# EAGLE design UAV_ARM_Revision_2 (EAGLE 7.1.0)
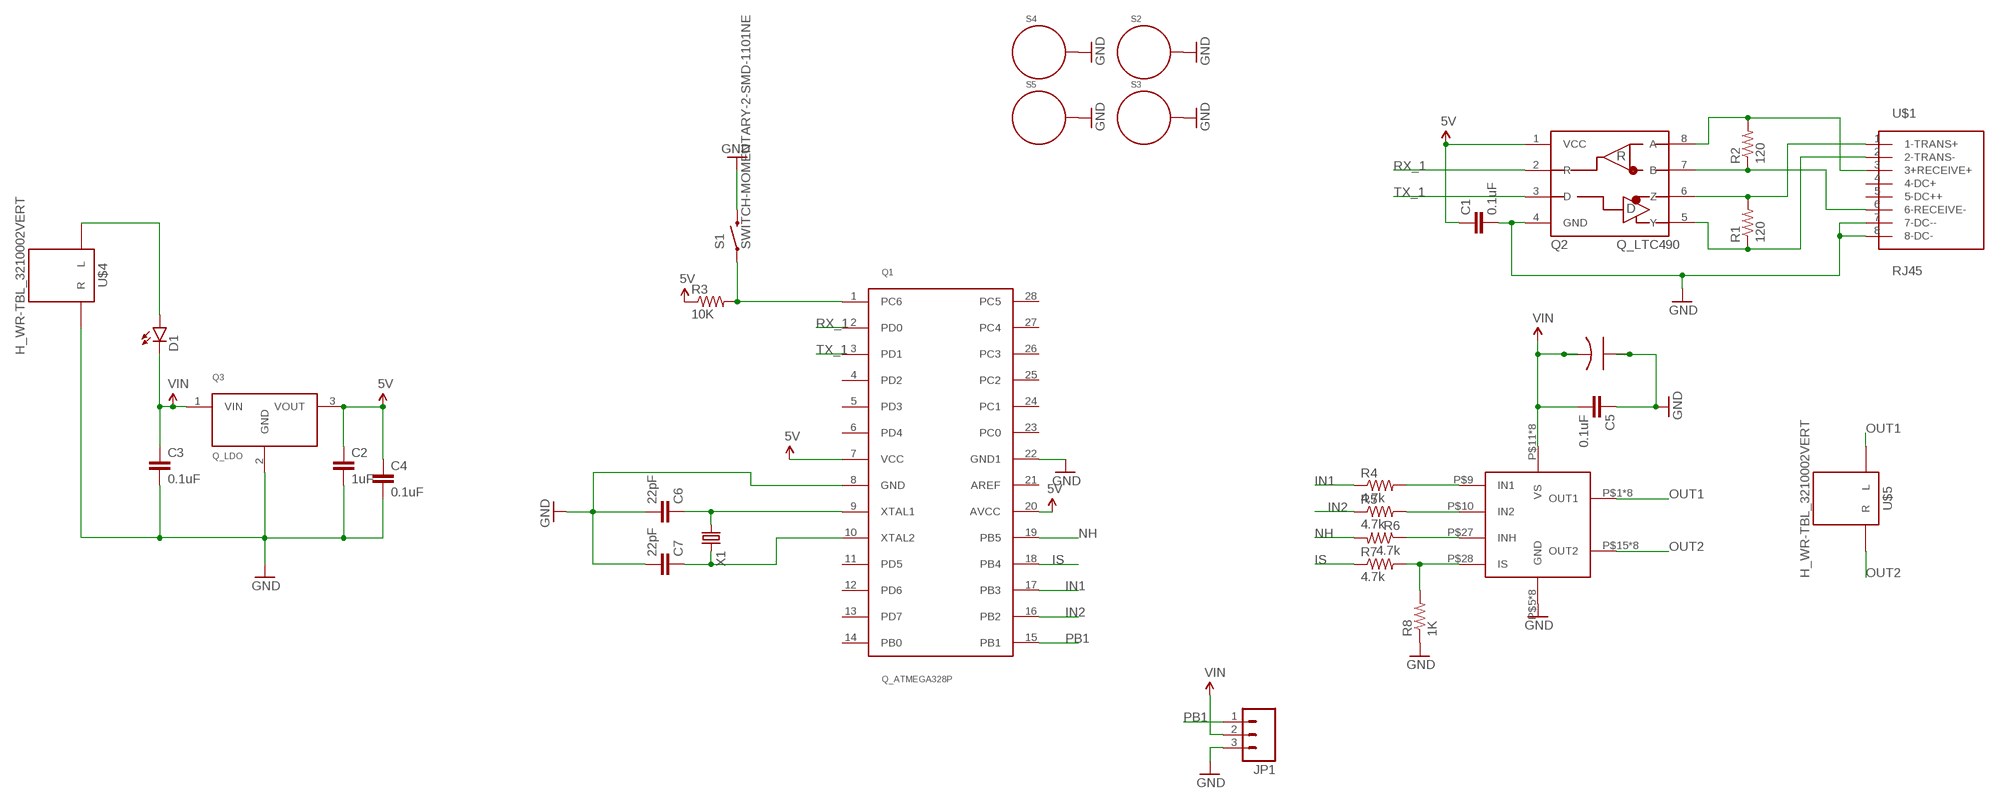
[diagram p0: schematic, sheet 1]

## Parts
C1  0.1uF  CAP1206  [1206]
C2  1uF  CAP1206  [1206]
C3  0.1uF  CAP1206  [1206]
C4  0.1uF  CAP1206  [1206]
C5  0.1uF  CAP1206  [1206]
C6  22pF  CAP1206  [1206]
C7  22pF  CAP1206  [1206]
D1  LED-FKIT-1206  [FKIT-LED-1206]
JP1  M03POLAR  [MOLEX-1X3]
Q1  Q_ATMEGA328P  [DIP28]
Q2  Q_LTC490  [DIP8]
Q3  Q_LDO  [TO-220]
R1  120  RESISTOR1206  [1206]
R2  120  RESISTOR1206  [1206]
R3  10K  RESISTOR1206  [1206]
R4  4.7k  RESISTOR1206  [1206]
R5  4.7k  RESISTOR1206  [1206]
R6  4.7k  RESISTOR1206  [1206]
R7  4.7k  RESISTOR1206  [1206]
R8  1K  RESISTOR1206  [1206]
S1  SWITCH-MOMENTARY-2-SMD-1101NE  [TACTILE-SWITCH-1101NE]
S2  STANDOFF_ELECTRICAL  [STANDOFF-ELECTRICAL]
S3  STANDOFF_ELECTRICAL  [STANDOFF-ELECTRICAL]
S4  STANDOFF_ELECTRICAL  [STANDOFF-ELECTRICAL]
S5  STANDOFF_ELECTRICAL  [STANDOFF-ELECTRICAL]
U$1  RJ45  [RJ45-CAT5E]
U$2  BTM7752G  [BTM7752G]
U$3  100UF-ELECTRO-CAP  [ELECTRO-CAP]
U$4  H_WR-TBL_3210002VERT  [691321100002]
U$5  H_WR-TBL_3210002VERT  [691321100002]
X1  CRYSTALHC49US  [HC49US]

## Nets
5V: C1.1 C2.1 C4.1 Q1.7(VCC) Q1.20(AVCC) Q2.1(VCC) Q3.3(VOUT) R3.1
GND: C1.2 C2.2 C3.2 C4.2 C5.1 C6.2 C7.2 JP1.3 Q1.8(GND) Q1.22(GND1) Q2.4(GND) Q3.2(GND) R8.1 S1.2 S2.P1 S3.P1 S4.P1 S5.P1 U$1.7(7-DC--) U$1.8(8-DC-) U$2.P$5(GND) U$2.P$6(GND) U$2.P$7(GND) U$2.P$8(GND) U$2.P$23(GND) U$2.P$24(GND) U$2.P$25(GND) U$2.P$26(GND) U$3.NEG U$4.R
IN1: Q1.17(PB3) R4.1
IN2: Q1.16(PB2) R5.1
IS: Q1.18(PB4) R7.1
N$1: Q2.8(A) R2.2 U$1.3(3+RECEIVE+)
N$2: Q2.7(B) R2.1 U$1.6(6-RECEIVE-)
N$3: Q2.5(Y) R1.1 U$1.2(2-TRANS-)
N$4: Q2.6(Z) R1.2 U$1.1(1-TRANS+)
N$5: D1.A U$4.L
N$6: R5.2 U$2.P$10(IN2)
N$7: R4.2 U$2.P$9(IN1)
N$8: R7.2 R8.2 U$2.P$28(IS)
N$9: Q1.1(PC6) R3.2 S1.1
N$10: C6.1 Q1.9(XTAL1) X1.1
N$11: C7.1 Q1.10(XTAL2) X1.2
N$12: R6.1 U$2.P$27(INH)
N$17: C5.2 U$2.P$11(VS) U$2.P$12(VS) U$2.P$13(VS) U$2.P$14(VS) U$2.P$29(VS) U$2.P$30(VS) U$2.P$31(VS) U$2.P$32(VS) U$3.POS
NH: Q1.19(PB5) R6.2
OUT1: U$2.P$1(OUT1) U$2.P$2(OUT1) U$2.P$3(OUT1) U$2.P$4(OUT1) U$2.P$33(OUT1) U$2.P$34(OUT1) U$2.P$35(OUT1) U$2.P$36(OUT1) U$5.L
OUT2: U$2.P$15(OUT2) U$2.P$16(OUT2) U$2.P$17(OUT2) U$2.P$18(OUT2) U$2.P$19(OUT2) U$2.P$20(OUT2) U$2.P$21(OUT2) U$2.P$22(OUT2) U$5.R
PB1: JP1.1 Q1.15(PB1)
RX_1: Q1.2(PD0) Q2.2(R)
TX_1: Q1.3(PD1) Q2.3(D)
VIN: C3.1 D1.C JP1.2 Q3.1(VIN)
Unconnected: Q1.4(PD2) Q1.5(PD3) Q1.6(PD4) Q1.11(PD5) Q1.12(PD6) Q1.13(PD7) Q1.14(PB0) Q1.21(AREF) Q1.23(PC0) Q1.24(PC1) Q1.25(PC2) Q1.26(PC3) Q1.27(PC4) Q1.28(PC5) U$1.4(4-DC+) U$1.5(5-DC++)

## Library data of the parts
C1 C2 C4-C7 = SparkFun-Passives:CAP: Capacitor Standard 0603 ceramic capacitor, and 0.1" leaded capacitor.
C3 = SparkFun-Capacitors:CAP: Capacitor Standard 0603 ceramic capacitor, and 0.1" leaded capacitor.
D1 = SparkFun-LED:LED: LEDs Standard schematic elements and footprints for 5mm, 3mm, 1206, and 0603 sized LEDs. 5mm - Spark Fun Electronics SKU : COM-00529 (and others)
JP1 = SparkFun-Connectors:M03: Header 3 Standard 3-pin 0.1" header. Use with straight break away headers (SKU : PRT-00116), right angle break away headers (PRT-00553), swiss pins (PRT-00743), machine pins (PRT-00117), and female headers (PRT-00115). Molex polarized connector foot print use with SKU : PRT-08232 with associated crimp pins and housings.
Q1 = MRDT-2014-All:Q_ATMEGA328P: ATMEGA 328P in 28PIN PDIP package
Q2 = MRDT-2014-All:Q_LTC490: IC, RS422-RS485 DRVR
Q3 = MRDT-2015-General:Q_LDO: LDO with fixed ouput voltage
R1-R8 = SparkFun-Passives:RESISTOR: Resistor Basic schematic elements and footprints for 0603, 1206, and PTH resistors.
S1 = SparkFun-Electromechanical:SWITCH-MOMENTARY-2: Various NO switches- pushbuttons, reed, etc
S2-S5 = SparkFun-Electromechanical:STANDOFF_ELECTRICAL: A standoff intended to be an electrically connected point. Pad size and stop size allow for a #4 Phillips pan screw head to make a solid connection to the board.
U$1 = MRDT-2014-All:RJ45
U$2 = MRDT-2015-General:BTM7752G
U$3 = New:100UF-ELECTRO-CAP
U$4 U$5 = MRDT-2015-PowerBoard:H_WR-TBL_32*1*0002: Wurth Electronic's 2-pin 10A pluggable screw terminal headers. Vertical and Horizantal Part Numbers: 691322110002 (Horizantal) 691321100002 (Vertical); DIGIKEY_PN: 732-2763-ND
X1 = SparkFun-FreqCtrl:CRYSTAL: Various standard crystals. Proven footprints. Spark Fun Electronics SKU : COM-00534

## Net classes
0 default: clearance 0.205 mm

## Board
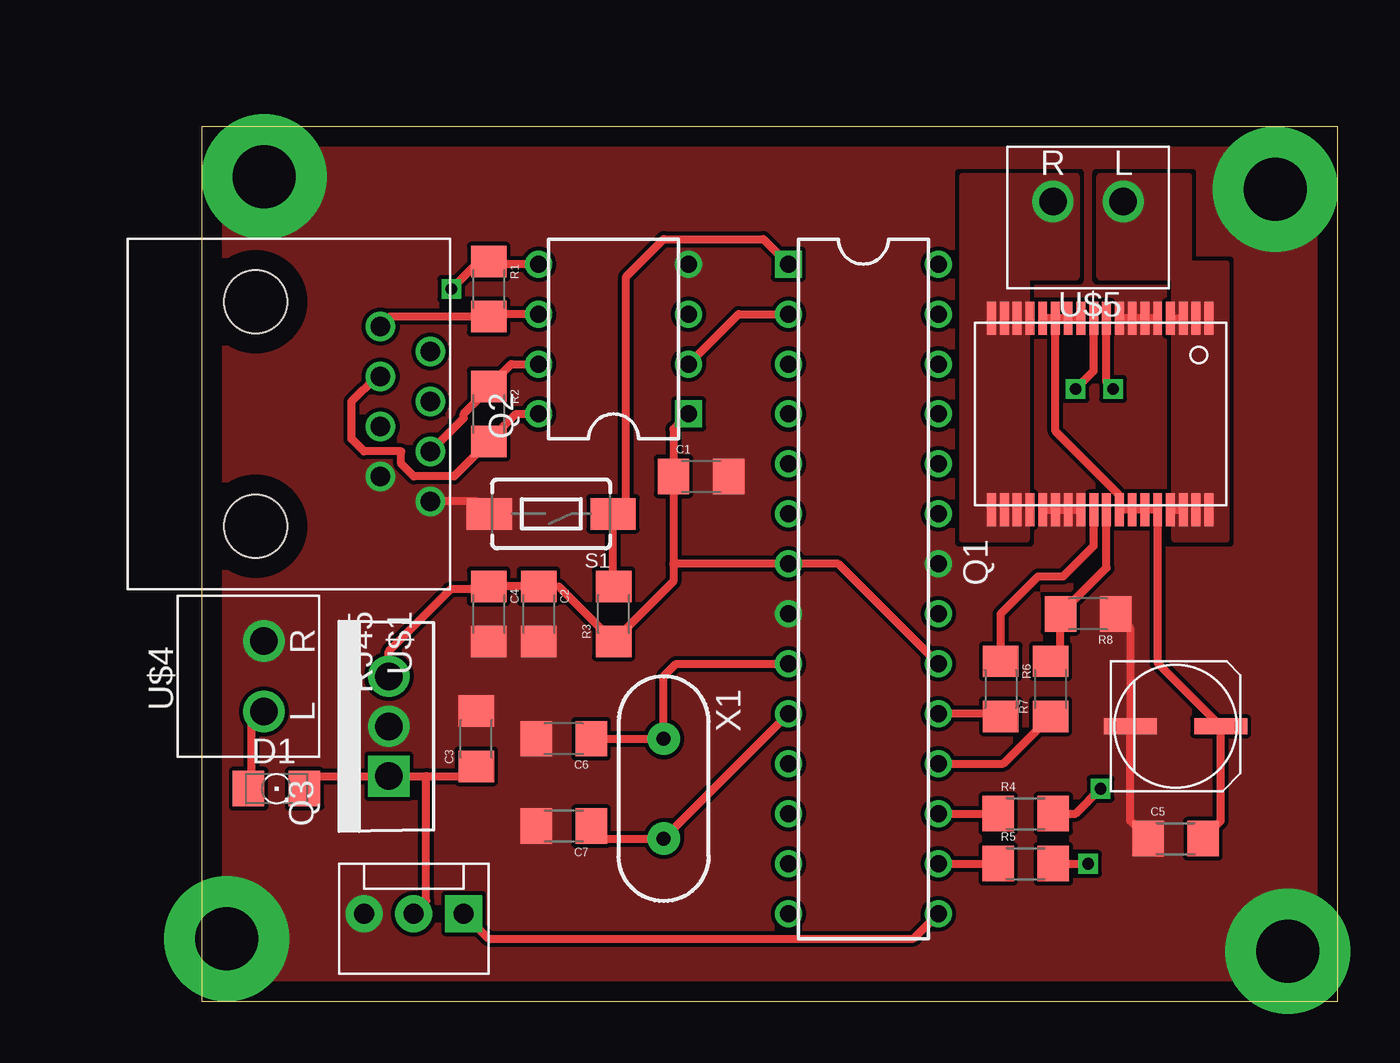
[diagram p1: board, top side]
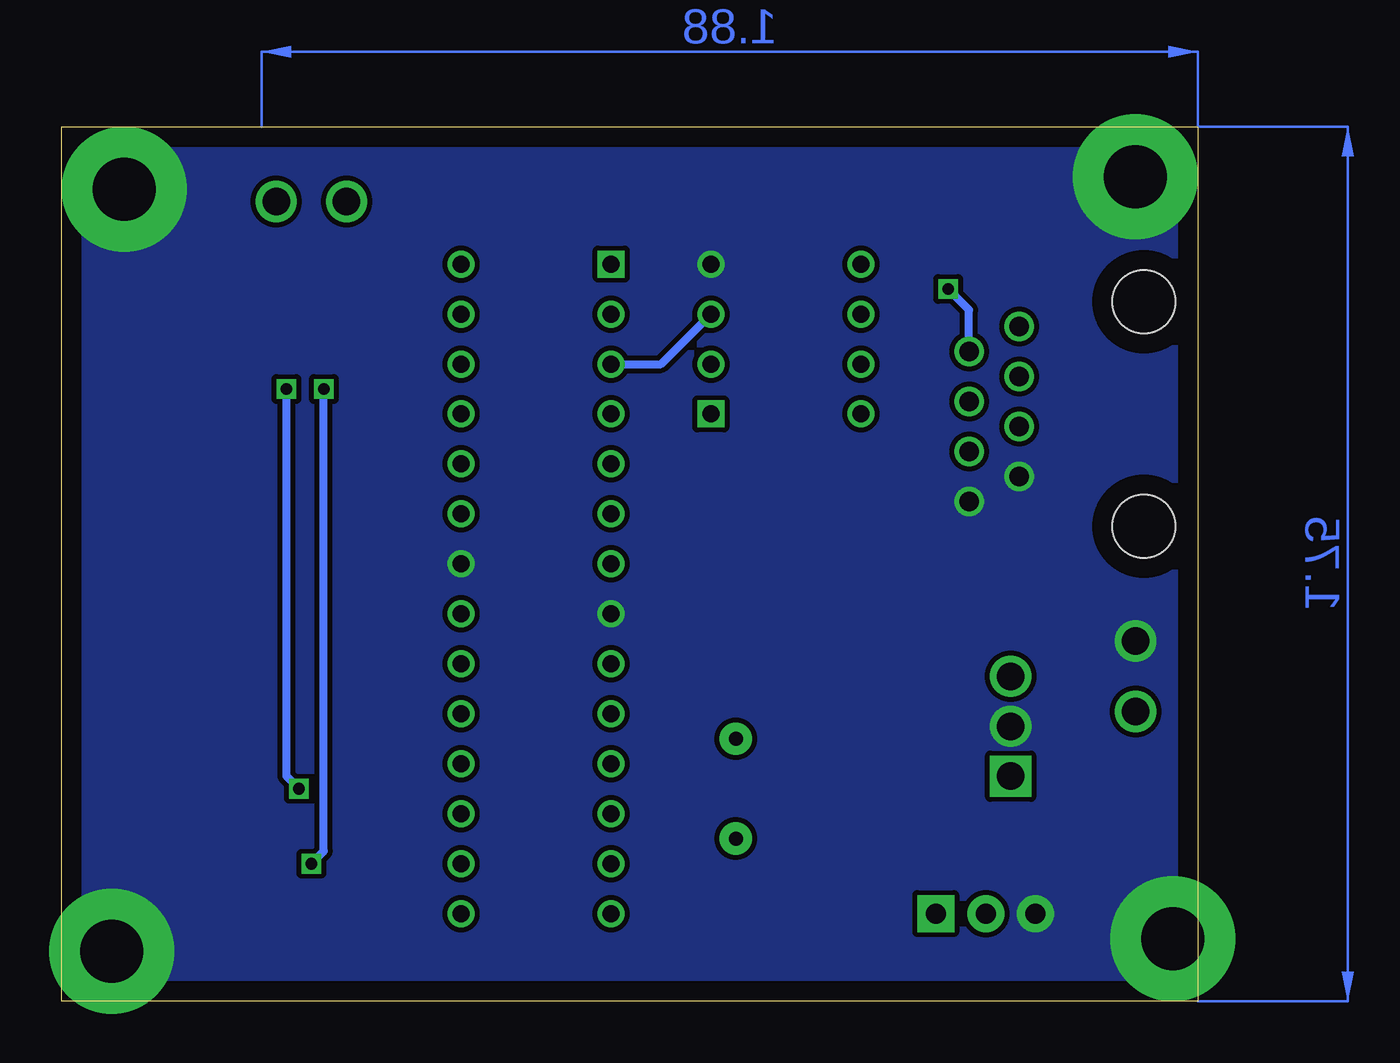
[diagram p2: board, bottom side, seen from below]

Size 57.78 x 44.45 mm. Coordinates in mm from the lower left corner, seen from the top.
Outline: 0,44.45 0,0 57.78,0 57.78,44.45 0,44.45
Copper layers (1*16): Top 0.035mm / dielectric 1.5mm / Bottom 0.035mm
Design rules "default": minimum track width 10mil, minimum drill 24mil, track to track 8mil, track to pad 8mil, pad to pad 8mil, via to via 8mil, smd to smd 8mil, copper to edge 40mil, drill to drill 8mil, minimum pad ring 10mil, minimum via ring 8mil, stop-mask expansion 4mil, vias tented up to drill 0mil, thermal gap 10mil

### Footprints (pad centres in the part's own frame; a part is rotated, then mirrored left to right if it is on the bottom)
1206 = smd 1.6 x 1.8: 1 -1.4,0; 2 1.4,0
FKIT-LED-1206 = smd 1.6 x 1.803: A -1.422,0; C 1.422,0
MOLEX-1X3 = drill 1.016 pad 1.88 square: 1 0,0 | drill 1.016 pad 1.88: 2 2.54,0; 3 5.08,0
DIP28 = drill 0.864 square: 1 -16.51,-3.81 | drill 0.864: 2 -13.97,-3.81; 3 -11.43,-3.81; 4 -8.89,-3.81; 5 -6.35,-3.81; 6 -3.81,-3.81; 7 -1.27,-3.81; 8 1.27,-3.81; 9 3.81,-3.81; 10 6.35,-3.81; 11 8.89,-3.81; 12 11.43,-3.81; 13 13.97,-3.81; 14 16.51,-3.81; 15 16.51,3.81; 16 13.97,3.81; 17 11.43,3.81; 18 8.89,3.81; 19 6.35,3.81; 20 3.81,3.81; 21 1.27,3.81; 22 -1.27,3.81; 23 -3.81,3.81; 24 -6.35,3.81; 25 -8.89,3.81; 26 -11.43,3.81; 27 -13.97,3.81; 28 -16.51,3.81
DIP8 = drill 0.864 square: 1 -3.81,-3.81 | drill 0.864: 2 -1.27,-3.81; 3 1.27,-3.81; 4 3.81,-3.81; 5 3.81,3.81; 6 1.27,3.81; 7 -1.27,3.81; 8 -3.81,3.81
TO-220 = drill 1.397 square: 1 -2.54,0 | drill 1.397: 2 0,0; 3 2.54,0
TACTILE-SWITCH-1101NE = smd 2.3 x 1.6: 1 -3.15,0; 2 3.15,0
STANDOFF-ELECTRICAL = drill 3.2 pad 6.35: P1 0,0
RJ45-CAT5E = drill 1: 1 -4.445,4.655; 2 -3.175,7.195; 3 -1.905,4.655; 4 -0.635,7.195; 5 0.635,4.655; 6 1.905,7.195; 7 3.175,4.655; 8 4.445,7.195 | hole 3.2: 5.715,-1.695; -5.715,-1.695
BTM7752G = smd 1.67 x 0.45: P$1 -4.865,5.5; P$2 -4.865,4.85; P$3 -4.865,4.2; P$4 -4.865,3.55; P$5 -4.865,2.9; P$6 -4.865,2.25; P$7 -4.865,1.6; P$8 -4.865,0.95; P$9 -4.865,0.3; P$10 -4.865,-0.35; P$11 -4.865,-1; P$12 -4.865,-1.65; P$13 -4.865,-2.3; P$14 -4.865,-2.95; P$15 -4.865,-3.6; P$16 -4.865,-4.25; P$17 -4.865,-4.9; P$18 -4.865,-5.55; P$19 4.865,-5.55; P$20 4.865,-4.9; P$21 4.865,-4.25; P$22 4.865,-3.6; P$23 4.865,-2.95; P$24 4.865,-2.3; P$25 4.865,-1.65; P$26 4.865,-1; P$27 4.865,-0.35; P$28 4.865,0.3; P$29 4.865,0.95; P$30 4.865,1.6; P$31 4.865,2.25; P$32 4.865,2.9; P$33 4.865,3.55; P$34 4.865,4.2; P$35 4.865,4.85; P$36 4.865,5.5
ELECTRO-CAP = smd 2.7 x 0.8: NEG -2.3,0; POS 2.3,0
691321100002 = drill 1.4: L -1.79,0; R 1.79,0
HC49US = drill 0.7 pad 1.651: 1 -2.54,0; 2 2.54,0

### Placement (x,y rotation side)
C1  25.4,26.67 0 top
C2  17.14,19.68 270 top
C3  13.97,13.34 90 top
C4  14.61,19.68 270 top
C5  49.53,8.25 0 top
C6  18.41,13.34 180 top
C7  18.41,8.89 180 top
D1  3.81,10.8 0 top
JP1  13.34,4.45 180 top
Q1  33.66,20.95 270 top
Q2  20.95,33.66 90 top
Q3  9.53,13.97 90 top
R1  14.61,36.2 270 top
R2  14.61,29.84 270 top
R3  20.95,19.68 90 top
R4  41.91,9.52 0 top
R5  41.91,6.98 0 top
R6  40.64,15.88 270 top
R7  43.18,15.88 90 top
R8  45.09,19.68 180 top
S1  17.78,24.77 180 top
S2  3.17,41.91 0 top
S3  54.61,41.27 0 top
S4  1.27,3.17 0 top
S5  55.24,2.54 0 top
U$1  4.45,29.84 270 top
U$2  45.72,29.84 270 top
U$3  49.53,13.97 0 top
U$4  H_WR-TBL_321*0002VERT  [691321100002]  3.17,16.51 90 top
U$5  H_WR-TBL_321*0002VERT  [691321100002]  45.09,40.64 180 top
X1  23.5,10.8 270 top

### Tracks (layer width: path | path; a pad name or v marks a point on that pad's centre or on a via)
5V
  Top 0.406: Q2.1 24,29.08 C1.1 24,22.23 | Q3.3 9.53,17.78 12.7,20.95 14.47,20.95 C4.1 C2.1 18.16,21.09 R3.1 24,21.33 24,22.23 | Q1.20 32.38,22.23 Q1.7 24,22.23
GND
  Top 0.406: C5.1 47.23,9.15 U$3.NEG 47.23,18.94 R8.1 | S1.2 13.99,25.4 U$1.8 | U$2.P$23 U$2.P$24 U$2.P$25 U$2.P$26 | U$2.P$5 U$2.P$6 U$2.P$7 U$2.P$8
  pour Bottom (isolate 0.254, no thermals): 0,0 57.78,0 57.78,44.45 0,44.45
  pour Top (rank 2, no thermals): 0,44.45 57.78,44.45 57.78,0 0,0
IN1
  Top 0.406: Q1.17 R4.1
IN2
  Top 0.406: Q1.16 R5.1
IS
  Top 0.406: Q1.18 40.77,12.06 R7.1
N$1
  Top 0.406: U$1.3 8.89,31.75 7.62,30.48 7.62,28.57 8.26,27.94 10.16,27.94 10.16,27.3 10.79,26.67 12.83,26.67 R2.2 16,29.84 Q2.8
N$2
  Top 0.406: Q2.7 15.74,32.38 R2.1 14.61,31.12 13.34,29.84 13.34,29.63 U$1.6
N$3  (via drill 0.6)
  Top 0.406: Q2.5 14.73,37.46 R1.1 14.1,37.59 v12.7,36.2
  Bottom 0.406: U$1.2 11.64,35.13 v12.7,36.2
N$4
  Top 0.406: Q2.6 14.73,34.92 R1.2 9.61,34.8 U$1.1
N$5
  Top 0.406: D1.A 2.54,10.95 2.54,14.09 U$4.L
N$6  (via drill 0.6)
  Top 0.406: R5.2 v45.09,6.98 | v44.45,31.12 45.37,32.03 U$2.P$10
  Bottom 0.406: v45.09,6.98 44.45,7.62 v44.45,31.12
N$7  (via drill 0.6)
  Top 0.406: R4.2 44.45,9.52 v45.72,10.8 | v46.35,31.12 46.02,31.45 U$2.P$9
  Bottom 0.406: v45.72,10.8 46.35,11.43 v46.35,31.12
N$8
  Top 0.406: R7.2 43.69,17.78 R8.2 46.02,22.02 U$2.P$28
N$9
  Top 0.406: Q1.1 28.57,38.73 23.5,38.73 21.59,36.83 21.59,25.42 S1.1 20.93,20.98 20.95,20.95 R3.2
N$10
  Top 0.406: C6.1 X1.1 23.5,16.51 24.13,17.14 Q1.9
N$11
  Top 0.406: C7.1 20.45,8.25 X1.2 Q1.10
N$12
  Top 0.406: R6.1 40.64,19.68 42.55,21.59 43.81,21.59 45.37,23.14 U$2.P$27
N$17
  Top 0.406: C5.2 51.83,9.15 U$3.POS 48.62,17.18 U$2.P$32 U$2.P$31 U$2.P$30 U$2.P$29 46.67,25.72 43.42,28.97 U$2.P$13 | U$2.P$11 U$2.P$12 U$2.P$13 | U$2.P$13 U$2.P$14
NH
  Top 0.406: R6.2 40.51,14.6 Q1.19
OUT1
  Top 0.406: U$2.P$33 U$2.P$34 | U$2.P$4 U$2.P$3
  pour Top (no thermals): 45.72,41.91 50.16,41.91 50.16,37.46 52.07,37.46 52.07,23.49 49.53,23.49 49.53,36.83 45.72,36.83
OUT2
  pour Top (no thermals): 44.45,41.91 44.45,36.83 41.91,36.83 41.91,23.49 38.73,23.49 38.73,41.91
PB1
  Top 0.406: JP1.1 14.61,3.17 36.2,3.17 Q1.15
RX_1
  Top 0.406: Q2.2 27.3,34.92 Q1.2
TX_1
  Bottom 0.406: Q1.3 27.3,32.38 Q2.3
VIN
  Top 0.406: D1.C 5.87,11.43 Q3.1 11.43,11.43 | 11.43,11.43 13.46,11.43 C3.1 | JP1.2 11.43,5.08 11.43,11.43
(copper drawn outside any net)
  shapes: Bottom area x2